# Altium schematic sheet SOC PinOut.SchDoc
size A2; DocumentNumber: 13; SheetNumber: 14; SheetTotal: 14
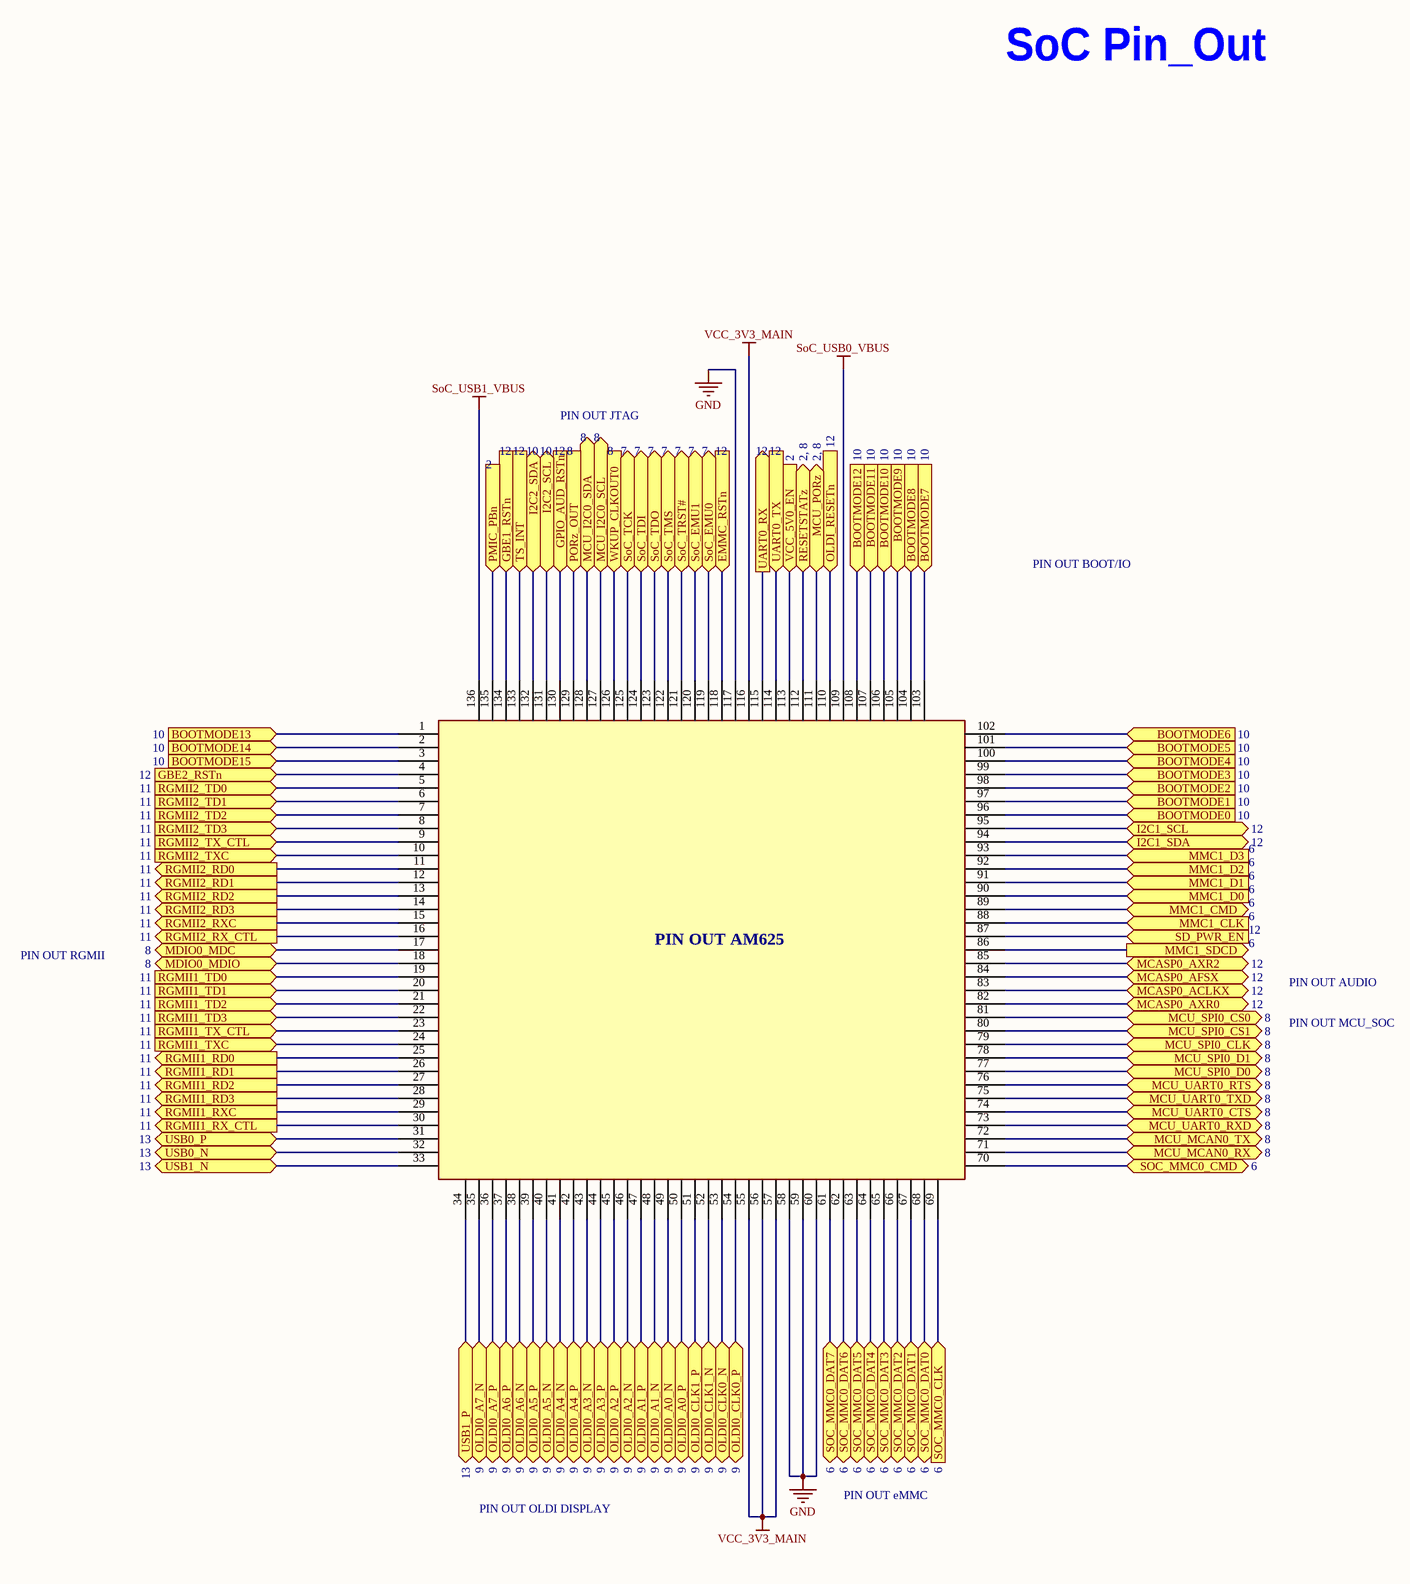
[diagram p0: SOC PinOut.SchDoc]

## Parts
PIN1  Pin OUT AM625  [PIN_OUT AM625 - 136PIN]  (value not drawn)

## Ports
BOOTMODE0 (in, see 10), BOOTMODE1 (in, see 10), BOOTMODE2 (in, see 10), BOOTMODE3 (in, see 10), BOOTMODE4 (in, see 10), BOOTMODE5 (in, see 10), BOOTMODE6 (in, see 10), BOOTMODE7 (in, see 10), BOOTMODE8 (in, see 10), BOOTMODE9 (in, see 10), BOOTMODE10 (in, see 10), BOOTMODE11 (in, see 10), BOOTMODE12 (in, see 10), BOOTMODE13 (in, see 10), BOOTMODE14 (in, see 10), BOOTMODE15 (in, see 10), EMMC_RSTn (in, see 12), GBE1_RSTn (in, see 12), GBE2_RSTn (in, see 12), GPIO_AUD_RSTn (in, see 12), I2C1_SCL (bidir, see 12), I2C1_SDA (bidir, see 12), I2C2_SCL (bidir, see 10), I2C2_SDA (bidir, see 10), MCASP0_ACLKX (bidir, see 12), MCASP0_AFSX (bidir, see 12), MCASP0_AXR0 (bidir, see 12), MCASP0_AXR2 (bidir, see 12), MCU_I2C0_SCL (bidir, see 8), MCU_I2C0_SDA (bidir, see 8), MCU_MCAN0_RX (bidir, see 8), MCU_MCAN0_TX (bidir, see 8), MCU_PORz (bidir, see 2, 8), MCU_SPI0_CLK (bidir, see 8), MCU_SPI0_CS0 (bidir, see 8), MCU_SPI0_CS1 (bidir, see 8), MCU_SPI0_D0 (bidir, see 8), MCU_SPI0_D1 (bidir, see 8), MCU_UART0_CTS (bidir, see 8), MCU_UART0_RTS (bidir, see 8), MCU_UART0_RXD (bidir, see 8), MCU_UART0_TXD (bidir, see 8), MDIO0_MDC (bidir, see 8), MDIO0_MDIO (bidir, see 8), MMC1_CLK (in, see 6), MMC1_CMD (bidir, see 6), MMC1_D0 (in, see 6), MMC1_D1 (in, see 6), MMC1_D2 (in, see 6), MMC1_D3 (in, see 6), MMC1_SDCD (out, see 6), OLDI0_A0_N (bidir, see 9), OLDI0_A0_P (bidir, see 9), OLDI0_A1_N (bidir, see 9), OLDI0_A1_P (bidir, see 9), OLDI0_A2_N (bidir, see 9), OLDI0_A2_P (bidir, see 9), OLDI0_A3_N (bidir, see 9), OLDI0_A3_P (bidir, see 9), OLDI0_A4_N (bidir, see 9), OLDI0_A4_P (bidir, see 9), OLDI0_A5_N (bidir, see 9), OLDI0_A5_P (bidir, see 9), OLDI0_A6_N (bidir, see 9), OLDI0_A6_P (bidir, see 9), OLDI0_A7_N (bidir, see 9), OLDI0_A7_P (bidir, see 9), OLDI0_CLK0_N (bidir, see 9), OLDI0_CLK0_P (bidir, see 9), OLDI0_CLK1_N (bidir, see 9), OLDI0_CLK1_P (bidir, see 9), OLDI_RESETn (in, see 12), PMIC_PBn (in, see 2), PORz_OUT (in, see 8), RESETSTATz (bidir, see 2, 8), RGMII1_RD0 (out, see 11), RGMII1_RD1 (out, see 11), RGMII1_RD2 (out, see 11), RGMII1_RD3 (out, see 11), RGMII1_RX_CTL (out, see 11), RGMII1_RXC (out, see 11), RGMII1_TD0 (in, see 11), RGMII1_TD1 (in, see 11), RGMII1_TD2 (in, see 11), RGMII1_TD3 (in, see 11), RGMII1_TX_CTL (in, see 11), RGMII1_TXC (in, see 11), RGMII2_RD0 (out, see 11), RGMII2_RD1 (out, see 11), RGMII2_RD2 (out, see 11), RGMII2_RD3 (out, see 11), RGMII2_RX_CTL (out, see 11), RGMII2_RXC (out, see 11), RGMII2_TD0 (in, see 11), RGMII2_TD1 (in, see 11), RGMII2_TD2 (in, see 11), RGMII2_TD3 (in, see 11), RGMII2_TX_CTL (in, see 11), RGMII2_TXC (in, see 11), SD_PWR_EN (in, see 12), SoC_EMU0 (bidir, see 7), SoC_EMU1 (bidir, see 7), SOC_MMC0_CLK (in, see 6), SOC_MMC0_CMD (bidir, see 6), SOC_MMC0_DAT0 (bidir, see 6), SOC_MMC0_DAT1 (bidir, see 6), SOC_MMC0_DAT2 (bidir, see 6), SOC_MMC0_DAT3 (bidir, see 6), SOC_MMC0_DAT4 (bidir, see 6), SOC_MMC0_DAT5 (bidir, see 6), SOC_MMC0_DAT6 (bidir, see 6), SOC_MMC0_DAT7 (bidir, see 6), SoC_TCK (bidir, see 7), SoC_TDI (bidir, see 7), SoC_TDO (bidir, see 7), SoC_TMS (bidir, see 7), SoC_TRST# (bidir, see 7), TS_INT (in, see 12), UART0_RX (out, see 12), UART0_TX (in, see 12), USB0_N (bidir, see 13), USB0_P (bidir, see 13), USB1_N (bidir, see 13), USB1_P (bidir, see 13), VCC_5V0_EN (in, see 2), WKUP_CLKOUT0 (in, see 8)

## Nets
GND: PIN1.58 PIN1.59 PIN1.60 PIN1.117
SoC_USB0_VBUS: PIN1.109
SoC_USB1_VBUS: PIN1.136
VCC_3V3_MAIN: PIN1.55 PIN1.56 PIN1.57 PIN1.116
BOOTMODE0: PIN1.96 ; port BOOTMODE0
BOOTMODE1: PIN1.97 ; port BOOTMODE1
BOOTMODE2: PIN1.98 ; port BOOTMODE2
BOOTMODE3: PIN1.99 ; port BOOTMODE3
BOOTMODE4: PIN1.100 ; port BOOTMODE4
BOOTMODE5: PIN1.101 ; port BOOTMODE5
BOOTMODE6: PIN1.102 ; port BOOTMODE6
BOOTMODE7: PIN1.103 ; port BOOTMODE7
BOOTMODE8: PIN1.104 ; port BOOTMODE8
BOOTMODE9: PIN1.105 ; port BOOTMODE9
BOOTMODE10: PIN1.106 ; port BOOTMODE10
BOOTMODE11: PIN1.107 ; port BOOTMODE11
BOOTMODE12: PIN1.108 ; port BOOTMODE12
BOOTMODE13: PIN1.1 ; port BOOTMODE13
BOOTMODE14: PIN1.2 ; port BOOTMODE14
BOOTMODE15: PIN1.3 ; port BOOTMODE15
EMMC_RSTn: PIN1.118 ; port EMMC_RSTn
GBE1_RSTn: PIN1.134 ; port GBE1_RSTn
GBE2_RSTn: PIN1.4 ; port GBE2_RSTn
GPIO_AUD_RSTn: PIN1.130 ; port GPIO_AUD_RSTn
I2C1_SCL: PIN1.95 ; port I2C1_SCL
I2C1_SDA: PIN1.94 ; port I2C1_SDA
I2C2_SCL: PIN1.131 ; port I2C2_SCL
I2C2_SDA: PIN1.132 ; port I2C2_SDA
MCASP0_ACLKX: PIN1.83 ; port MCASP0_ACLKX
MCASP0_AFSX: PIN1.84 ; port MCASP0_AFSX
MCASP0_AXR0: PIN1.82 ; port MCASP0_AXR0
MCASP0_AXR2: PIN1.85 ; port MCASP0_AXR2
MCU_I2C0_SCL: PIN1.127 ; port MCU_I2C0_SCL
MCU_I2C0_SDA: PIN1.128 ; port MCU_I2C0_SDA
MCU_MCAN0_RX: PIN1.71 ; port MCU_MCAN0_RX
MCU_MCAN0_TX: PIN1.72 ; port MCU_MCAN0_TX
MCU_PORz: PIN1.111 ; port MCU_PORz
MCU_SPI0_CLK: PIN1.79 ; port MCU_SPI0_CLK
MCU_SPI0_CS0: PIN1.81 ; port MCU_SPI0_CS0
MCU_SPI0_CS1: PIN1.80 ; port MCU_SPI0_CS1
MCU_SPI0_D0: PIN1.77 ; port MCU_SPI0_D0
MCU_SPI0_D1: PIN1.78 ; port MCU_SPI0_D1
MCU_UART0_CTS: PIN1.74 ; port MCU_UART0_CTS
MCU_UART0_RTS: PIN1.76 ; port MCU_UART0_RTS
MCU_UART0_RXD: PIN1.73 ; port MCU_UART0_RXD
MCU_UART0_TXD: PIN1.75 ; port MCU_UART0_TXD
MDIO0_MDC: PIN1.17 ; port MDIO0_MDC
MDIO0_MDIO: PIN1.18 ; port MDIO0_MDIO
MMC1_CLK: PIN1.88 ; port MMC1_CLK
MMC1_CMD: PIN1.89 ; port MMC1_CMD
MMC1_D0: PIN1.90 ; port MMC1_D0
MMC1_D1: PIN1.91 ; port MMC1_D1
MMC1_D2: PIN1.92 ; port MMC1_D2
MMC1_D3: PIN1.93 ; port MMC1_D3
MMC1_SDCD: PIN1.86 ; port MMC1_SDCD
OLDI0_A0_N: PIN1.49 ; port OLDI0_A0_N
OLDI0_A0_P: PIN1.50 ; port OLDI0_A0_P
OLDI0_A1_N: PIN1.48 ; port OLDI0_A1_N
OLDI0_A1_P: PIN1.47 ; port OLDI0_A1_P
OLDI0_A2_N: PIN1.46 ; port OLDI0_A2_N
OLDI0_A2_P: PIN1.45 ; port OLDI0_A2_P
OLDI0_A3_N: PIN1.43 ; port OLDI0_A3_N
OLDI0_A3_P: PIN1.44 ; port OLDI0_A3_P
OLDI0_A4_N: PIN1.41 ; port OLDI0_A4_N
OLDI0_A4_P: PIN1.42 ; port OLDI0_A4_P
OLDI0_A5_N: PIN1.40 ; port OLDI0_A5_N
OLDI0_A5_P: PIN1.39 ; port OLDI0_A5_P
OLDI0_A6_N: PIN1.38 ; port OLDI0_A6_N
OLDI0_A6_P: PIN1.37 ; port OLDI0_A6_P
OLDI0_A7_N: PIN1.35 ; port OLDI0_A7_N
OLDI0_A7_P: PIN1.36 ; port OLDI0_A7_P
OLDI0_CLK0_N: PIN1.53 ; port OLDI0_CLK0_N
OLDI0_CLK0_P: PIN1.54 ; port OLDI0_CLK0_P
OLDI0_CLK1_N: PIN1.52 ; port OLDI0_CLK1_N
OLDI0_CLK1_P: PIN1.51 ; port OLDI0_CLK1_P
OLDI_RESETn: PIN1.110 ; port OLDI_RESETn
PMIC_PBn: PIN1.135 ; port PMIC_PBn
PORz_OUT: PIN1.129 ; port PORz_OUT
RESETSTATz: PIN1.112 ; port RESETSTATz
RGMII1_RD0: PIN1.25 ; port RGMII1_RD0
RGMII1_RD1: PIN1.26 ; port RGMII1_RD1
RGMII1_RD2: PIN1.27 ; port RGMII1_RD2
RGMII1_RD3: PIN1.28 ; port RGMII1_RD3
RGMII1_RX_CTL: PIN1.30 ; port RGMII1_RX_CTL
RGMII1_RXC: PIN1.29 ; port RGMII1_RXC
RGMII1_TD0: PIN1.19 ; port RGMII1_TD0
RGMII1_TD1: PIN1.20 ; port RGMII1_TD1
RGMII1_TD2: PIN1.21 ; port RGMII1_TD2
RGMII1_TD3: PIN1.22 ; port RGMII1_TD3
RGMII1_TX_CTL: PIN1.23 ; port RGMII1_TX_CTL
RGMII1_TXC: PIN1.24 ; port RGMII1_TXC
RGMII2_RD0: PIN1.11 ; port RGMII2_RD0
RGMII2_RD1: PIN1.12 ; port RGMII2_RD1
RGMII2_RD2: PIN1.13 ; port RGMII2_RD2
RGMII2_RD3: PIN1.14 ; port RGMII2_RD3
RGMII2_RX_CTL: PIN1.16 ; port RGMII2_RX_CTL
RGMII2_RXC: PIN1.15 ; port RGMII2_RXC
RGMII2_TD0: PIN1.5 ; port RGMII2_TD0
RGMII2_TD1: PIN1.6 ; port RGMII2_TD1
RGMII2_TD2: PIN1.7 ; port RGMII2_TD2
RGMII2_TD3: PIN1.8 ; port RGMII2_TD3
RGMII2_TX_CTL: PIN1.9 ; port RGMII2_TX_CTL
RGMII2_TXC: PIN1.10 ; port RGMII2_TXC
SD_PWR_EN: PIN1.87 ; port SD_PWR_EN
SoC_EMU0: PIN1.119 ; port SoC_EMU0
SoC_EMU1: PIN1.120 ; port SoC_EMU1
SOC_MMC0_CLK: PIN1.69 ; port SOC_MMC0_CLK
SOC_MMC0_CMD: PIN1.70 ; port SOC_MMC0_CMD
SOC_MMC0_DAT0: PIN1.68 ; port SOC_MMC0_DAT0
SOC_MMC0_DAT1: PIN1.67 ; port SOC_MMC0_DAT1
SOC_MMC0_DAT2: PIN1.66 ; port SOC_MMC0_DAT2
SOC_MMC0_DAT3: PIN1.65 ; port SOC_MMC0_DAT3
SOC_MMC0_DAT4: PIN1.64 ; port SOC_MMC0_DAT4
SOC_MMC0_DAT5: PIN1.63 ; port SOC_MMC0_DAT5
SOC_MMC0_DAT6: PIN1.62 ; port SOC_MMC0_DAT6
SOC_MMC0_DAT7: PIN1.61 ; port SOC_MMC0_DAT7
SoC_TCK: PIN1.125 ; port SoC_TCK
SoC_TDI: PIN1.124 ; port SoC_TDI
SoC_TDO: PIN1.123 ; port SoC_TDO
SoC_TMS: PIN1.122 ; port SoC_TMS
SoC_TRST#: PIN1.121 ; port SoC_TRST#
TS_INT: PIN1.133 ; port TS_INT
UART0_RX: PIN1.115 ; port UART0_RX
UART0_TX: PIN1.114 ; port UART0_TX
USB0_N: PIN1.32 ; port USB0_N
USB0_P: PIN1.31 ; port USB0_P
USB1_N: PIN1.33 ; port USB1_N
USB1_P: PIN1.34 ; port USB1_P
VCC_5V0_EN: PIN1.113 ; port VCC_5V0_EN
WKUP_CLKOUT0: PIN1.126 ; port WKUP_CLKOUT0

## Notes on the sheet
- SoC Pin_Out
- PIN OUT JTAG
- PIN OUT BOOT/IO
- PIN OUT RGMII
- PIN OUT AUDIO
- PIN OUT MCU_SOC
- PIN OUT OLDI DISPLAY
- PIN OUT eMMC
- (in symbol PIN_OUT) PIN OUT AM625

## Library data of the parts
PIN1 = PIN_OUT